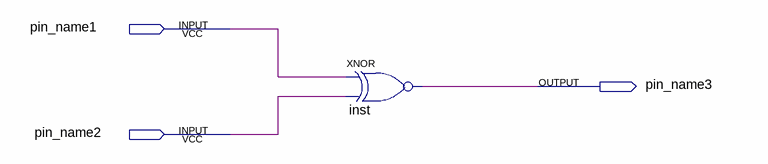
[diagram p0: schematic sheet]
// Quartus schematic xnor_gate.bdf as structural Verilog: 1 symbols, 3 pins
module xnor_gate (
  input  pin_name1,
  input  pin_name2,
  output pin_name3
);

  xnor inst (pin_name3, pin_name1, pin_name2);
endmodule
